# Altium project 175-00024, rev3, Backplane, Instrument Crate.PrjPcb
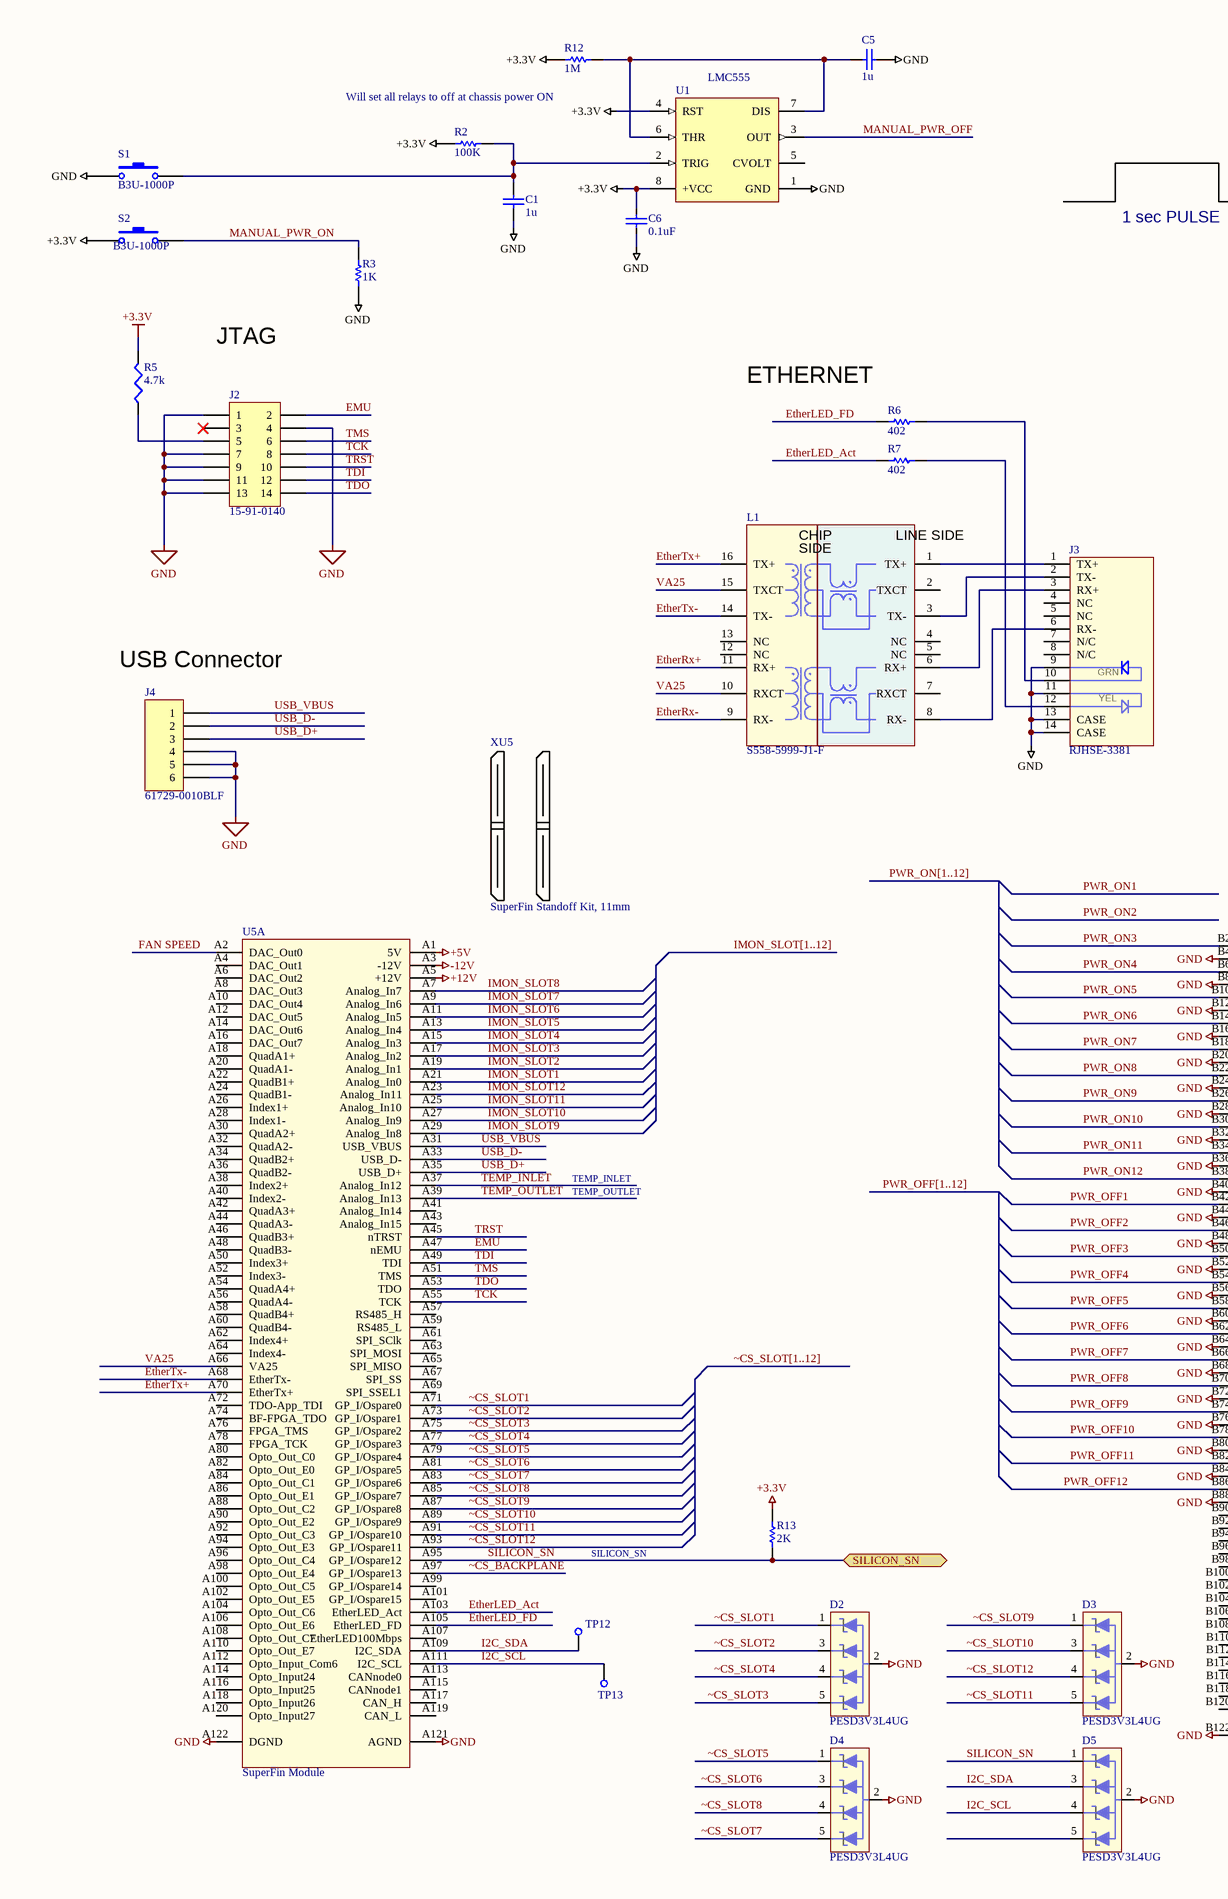
[diagram p0: 780-00029,rev3,Pg3,Backplane, Instrument Crate.SchDoc, left]
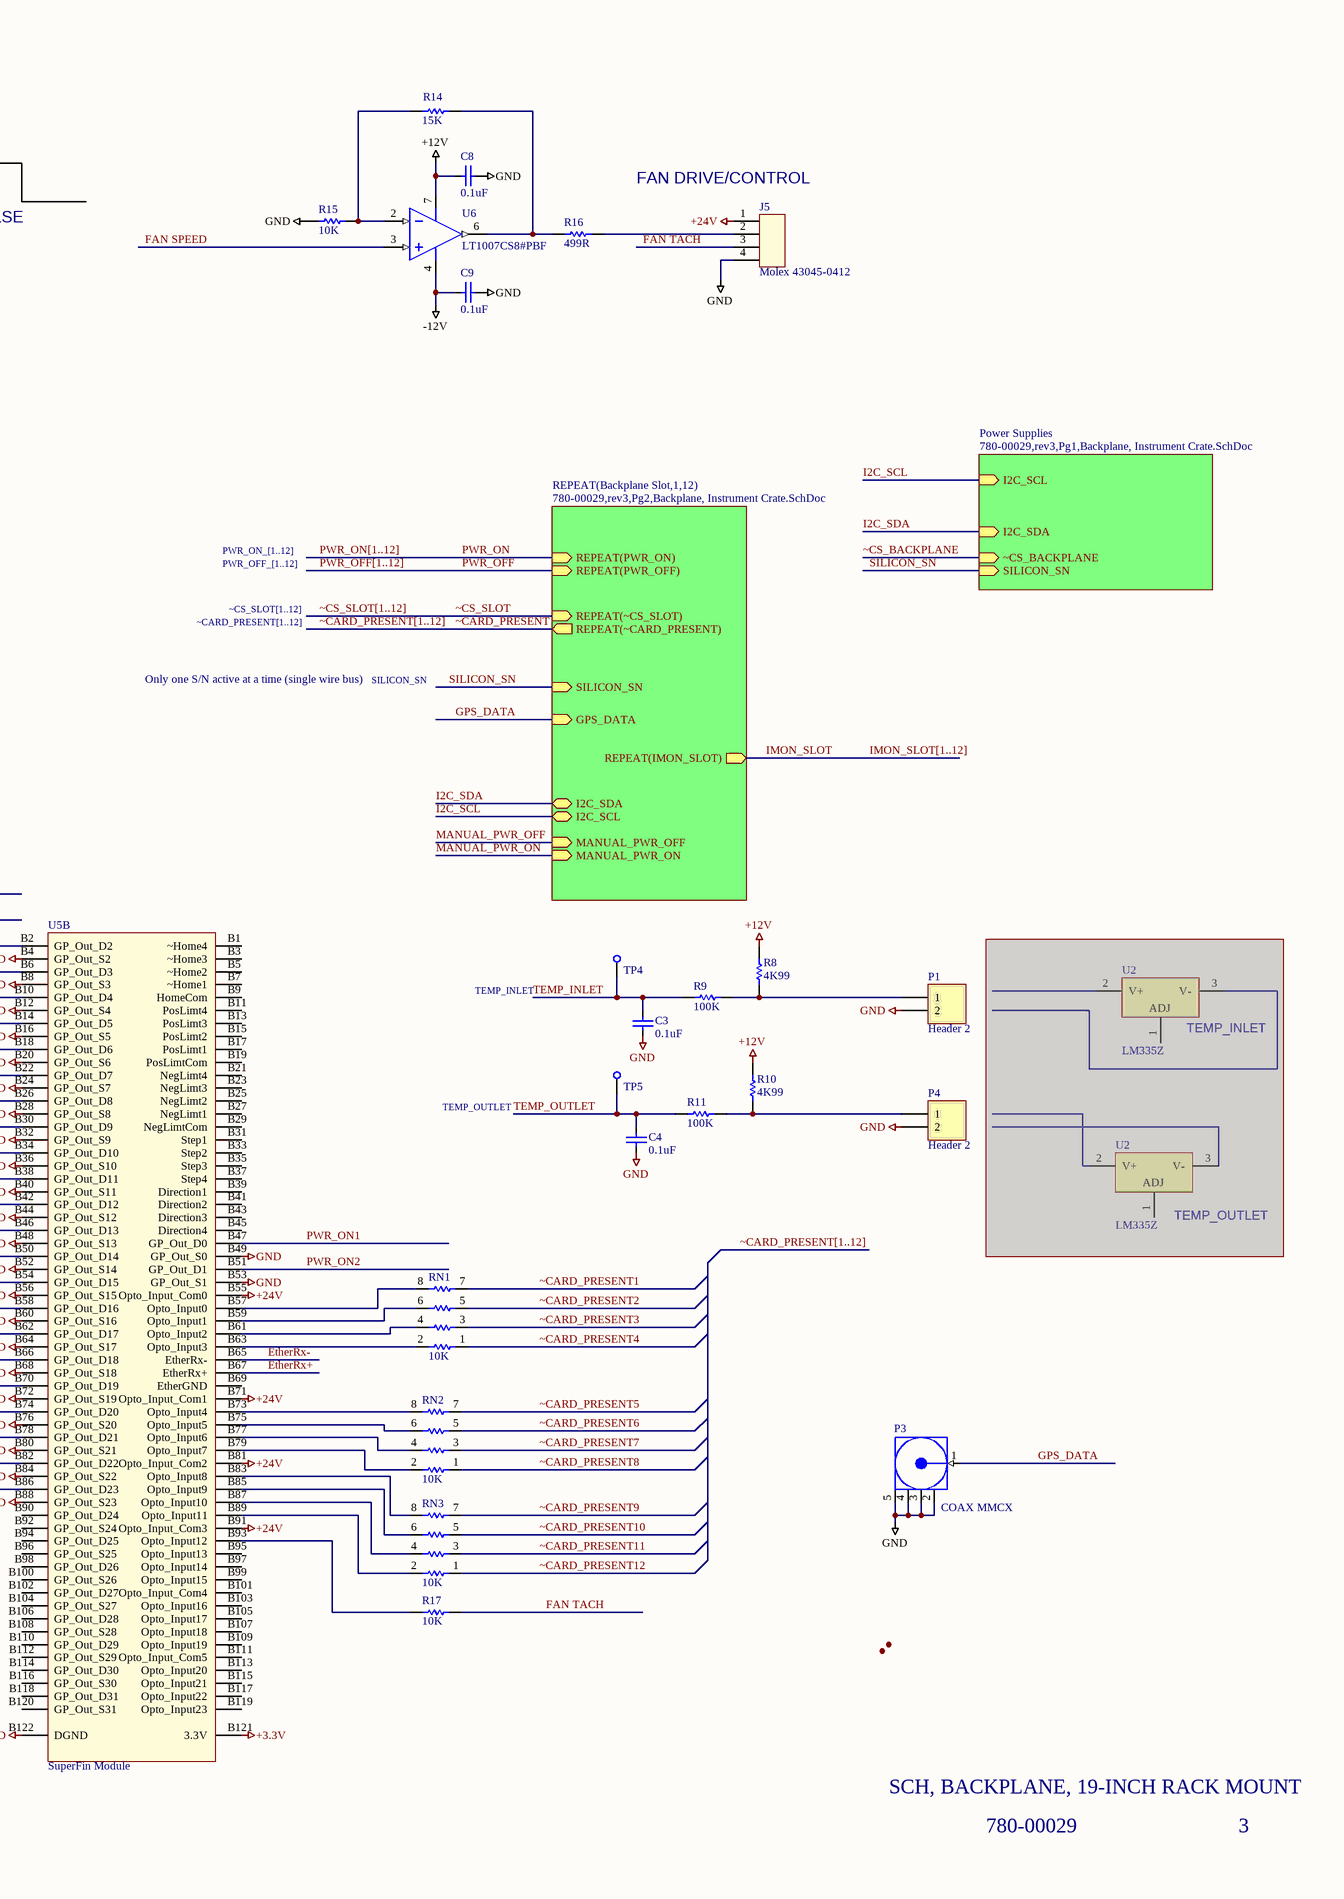
[diagram p1: 780-00029,rev3,Pg3,Backplane, Instrument Crate.SchDoc, right]
2 sheets, 289 parts. Net scope: hierarchical (ports join the sheet entries above them; power ports are global).
Board file: 175-00024_rev3, Backplane, Instrument Crate.PcbDoc
Sheets:
  780-00029,rev3,Pg3,Backplane, Instrument Crate.SchDoc
    Backplane Slot1 = 780-00029,rev3,Pg2,Backplane, Instrument Crate.SchDoc
    Backplane Slot2 = 780-00029,rev3,Pg2,Backplane, Instrument Crate.SchDoc
    Backplane Slot3 = 780-00029,rev3,Pg2,Backplane, Instrument Crate.SchDoc
    Backplane Slot4 = 780-00029,rev3,Pg2,Backplane, Instrument Crate.SchDoc
    Backplane Slot5 = 780-00029,rev3,Pg2,Backplane, Instrument Crate.SchDoc
    Backplane Slot6 = 780-00029,rev3,Pg2,Backplane, Instrument Crate.SchDoc
    Backplane Slot7 = 780-00029,rev3,Pg2,Backplane, Instrument Crate.SchDoc
    Backplane Slot8 = 780-00029,rev3,Pg2,Backplane, Instrument Crate.SchDoc
    Backplane Slot9 = 780-00029,rev3,Pg2,Backplane, Instrument Crate.SchDoc
    Backplane Slot10 = 780-00029,rev3,Pg2,Backplane, Instrument Crate.SchDoc
    Backplane Slot11 = 780-00029,rev3,Pg2,Backplane, Instrument Crate.SchDoc
    Backplane Slot12 = 780-00029,rev3,Pg2,Backplane, Instrument Crate.SchDoc

## Sheet 780-00029,rev3,Pg3,Backplane, Instrument Crate.SchDoc
size C

### Parts
(Parts that share a designator on the sheet are numbered #1, #2 ... from top to bottom, then left to right.)
C1  1u  [2012[0805]]
C3  value 0.1uF  [SMD_0805]  (hidden comment: Cap SMD)
C4  value 0.1uF  [SMD_0805]  (hidden comment: Cap SMD)
C5  1u  [SMD_0805]
C6  value 0.1uF  [SMD_0805]  (hidden comment: Cap SMD)
C8  value 0.1uF  [SMD_0805]  (hidden comment: Cap SMD)
C9  value 0.1uF  [SMD_0805]  (hidden comment: Cap SMD)
D2  PESD3V3L4UG  [SOT-353]
D3  PESD3V3L4UG  [SOT-353]
D4  PESD3V3L4UG  [SOT-353]
D5  PESD3V3L4UG  [SOT-353]
J2  15-91-0140  [HDR2X7]
J3  RJHSE-3381  [RJ45, VERT MOUNT, NO MAGNETICS]
J4  61729-0010BLF  [USB Vertical PCB]
J5  Molex 43045-0412  [CONN Molex Micro-fit, 4 POS]
L1  S558-5999-J1-F  [10/100BT Magetics module]
P1  Header 2  [HDR1X2 for IDC]
P3  COAX MMCX  [MMCX2.54-V5]
P4  Header 2  [HDR1X2 for IDC]
R2  value 100K  [SMD_0805]  (hidden comment: Res 0805)
R3  value 1K  [SMD_0805]  (hidden comment: Res 0805)
R5  4.7k  [2012[0805]]
R6  value 402  [SMD_0805]  (hidden comment: Res 0805)
R7  value 402  [SMD_0805]  (hidden comment: Res 0805)
R8  value 4K99  [SMD_0805]  (hidden comment: Res 0805)
R9  value 100K  [SMD_0805]  (hidden comment: Res 0805)
R10  value 4K99  [SMD_0805]  (hidden comment: Res 0805)
R11  value 100K  [SMD_0805]  (hidden comment: Res 0805)
R12  value 1M  [SMD_0805]  (hidden comment: Res 0805)
R13  value 2K  [SMD_0805]  (hidden comment: Res 0805)
R14  value 15K  [SMD_0805]  (hidden comment: Res 0805)
R15  value 10K  [SMD_0805]  (hidden comment: Res 0805)
R16  value 499R  [SMD_0805]  (hidden comment: Res 0805)
R17  value 10K  [SMD_0805]  (hidden comment: Res 0805)
RN1  value 10K  [RES ARRAY 0603 x 4]  (hidden comment: RES ARRAY  x4 10K)
RN2  value 10K  [RES ARRAY 0603 x 4]  (hidden comment: RES ARRAY  x4 10K)
RN3  value 10K  [RES ARRAY 0603 x 4]  (hidden comment: RES ARRAY  x4 10K)
S1  B3U-1000P  [B3U-1000P]
S2  B3U-1000P  [B3U-1000P]
TP4  Test Point SMD  [SMD_TEST POINT]  (value not drawn)
TP5  Test Point SMD  [SMD_TEST POINT]  (value not drawn)
TP12  Test Point SMD  [SMD_TEST POINT]  (value not drawn)
TP13  Test Point SMD  [SMD_TEST POINT]  (value not drawn)
U1  value LMC555  [M08A_M]  (hidden comment: LM555CMX)
U2#1  LM335Z  [Z03A]  (masked out: inside a compile mask, not in the netlist)
U2#2  LM335Z  [Z03A]  (masked out: inside a compile mask, not in the netlist)
U5  SuperFin Module  [SuperFin Footprint]  (parts A,B of 2)
U6  LT1007CS8#PBF  [S8_M]
XU5  SuperFin Standoff Kit, 11mm  (mechanical)

### Sub-sheets
Power Supplies = 780-00029,rev3,Pg1,Backplane, Instrument Crate.SchDoc (file not in this document): I2C_SCL (in), I2C_SDA (in), ~CS_BACKPLANE (in), SILICON_SN (in)
REPEAT(Backplane Slot,1,12) = 780-00029,rev3,Pg2,Backplane, Instrument Crate.SchDoc: MANUAL_PWR_OFF (in), MANUAL_PWR_ON (in), REPEAT(PWR_OFF) (in), REPEAT(PWR_ON) (in), GPS_DATA (in), I2C_SDA, I2C_SCL, REPEAT(~CS_SLOT) (in), REPEAT(~CARD_PRESENT) (out), SILICON_SN (in), REPEAT(IMON_SLOT) (out)

### Ports
SILICON_SN (bidir)

### Nets
+3.3V: C6.2 R2.2 R5.2 R12.1 R13.2 S2.1 U1.4(RST) U1.8(+VCC) U5.B121(3.3V)
+5V: U5.A1(5V)
+12V: C8.1 R8.2 R10.2 U5.A5(+12V) U6.7(V+)
+24V: J5.1 U5.B55(Opto_Input_Com0) U5.B71(Opto_Input_Com1) U5.B81(Opto_Input_Com2) U5.B91(Opto_Input_Com3)
-12V: C9.1 U5.A3(-12V) U6.4(V-)
GND: C1.1 C3.1 C4.1 C5.2 C6.1 C8.2 C9.2 D2.2 D3.2 D4.2 D5.2 J2.1 J2.4 J2.7 J2.9 J2.11 J2.13 J3.9(GRN-Anode) J3.11(YEL-Cathode) J3.13(CASE) J3.14(CASE) J4.4 J4.5 J4.6 J5.4 P1.2 P3.2(GND) P3.3(GND) P3.4(GND) P3.5(GND) P4.2 R3.1 R15.1 S1.1 U1.1(GND) U5.A121(AGND) U5.A122(DGND) U5.B4(GP_Out_S2) U5.B8(GP_Out_S3) U5.B12(GP_Out_S4) U5.B16(GP_Out_S5) U5.B20(GP_Out_S6) U5.B24(GP_Out_S7) U5.B28(GP_Out_S8) U5.B32(GP_Out_S9) U5.B36(GP_Out_S10) U5.B40(GP_Out_S11) U5.B44(GP_Out_S12) U5.B48(GP_Out_S13) U5.B49(GP_Out_S0) U5.B52(GP_Out_S14) U5.B53(GP_Out_S1) U5.B56(GP_Out_S15) U5.B60(GP_Out_S16) U5.B64(GP_Out_S17) U5.B68(GP_Out_S18) U5.B72(GP_Out_S19) U5.B76(GP_Out_S20) U5.B80(GP_Out_S21) U5.B84(GP_Out_S22) U5.B88(GP_Out_S23) U5.B122(DGND)
EMU: J2.2 U5.A47(nEMU)
EtherLED_Act: R7.1 U5.A103(EtherLED_Act)
EtherLED_FD: R6.1 U5.A105(EtherLED_FD)
EtherRx+: L1.11(RX+) U5.B67(EtherRx+)
EtherRx-: L1.9(RX-) U5.B65(EtherRx-)
EtherTx+: L1.16(TX+) U5.A70(EtherTx+)
EtherTx-: L1.14(TX-) U5.A68(EtherTx-)
FAN SPEED: U5.A2(DAC_Out0) U6.3(IN+)
FAN TACH: J5.3 R17.2
GPS_DATA: P3.1(Signal) ; sheet REPEAT(Backplane Slot,1,12)/GPS_DATA
I2C_SCL: D5.4 TP13.1(TP) U5.A111(I2C_SCL) ; sheet REPEAT(Backplane Slot,1,12)/I2C_SCL, sheet Power Supplies/I2C_SCL
I2C_SDA: D5.3 TP12.1(TP) U5.A109(I2C_SDA) ; sheet REPEAT(Backplane Slot,1,12)/I2C_SDA, sheet Power Supplies/I2C_SDA
IMON_SLOT: sheet REPEAT(Backplane Slot,1,12)/REPEAT(IMON_SLOT)
IMON_SLOT1: U5.A21(Analog_In0)
IMON_SLOT2: U5.A19(Analog_In1)
IMON_SLOT3: U5.A17(Analog_In2)
IMON_SLOT4: U5.A15(Analog_In3)
IMON_SLOT5: U5.A13(Analog_In4)
IMON_SLOT6: U5.A11(Analog_In5)
IMON_SLOT7: U5.A9(Analog_In6)
IMON_SLOT8: U5.A7(Analog_In7)
IMON_SLOT9: U5.A29(Analog_In8)
IMON_SLOT10: U5.A27(Analog_In9)
IMON_SLOT11: U5.A25(Analog_In10)
IMON_SLOT12: U5.A23(Analog_In11)
MANUAL_PWR_OFF: U1.3(OUT) ; sheet REPEAT(Backplane Slot,1,12)/MANUAL_PWR_OFF
MANUAL_PWR_ON: R3.2 S2.2 ; sheet REPEAT(Backplane Slot,1,12)/MANUAL_PWR_ON
PWR_OFF: sheet REPEAT(Backplane Slot,1,12)/REPEAT(PWR_OFF)
PWR_OFF1: U5.B42(GP_Out_D12)
PWR_OFF2: U5.B46(GP_Out_D13)
PWR_OFF3: U5.B50(GP_Out_D14)
PWR_OFF4: U5.B54(GP_Out_D15)
PWR_OFF5: U5.B58(GP_Out_D16)
PWR_OFF6: U5.B62(GP_Out_D17)
PWR_OFF7: U5.B66(GP_Out_D18)
PWR_OFF8: U5.B70(GP_Out_D19)
PWR_OFF9: U5.B74(GP_Out_D20)
PWR_OFF10: U5.B78(GP_Out_D21)
PWR_OFF11: U5.B82(GP_Out_D22)
PWR_OFF12: U5.B86(GP_Out_D23)
PWR_ON: sheet REPEAT(Backplane Slot,1,12)/REPEAT(PWR_ON)
PWR_ON1: U5.B47(GP_Out_D0)
PWR_ON2: U5.B51(GP_Out_D1)
PWR_ON3: U5.B2(GP_Out_D2)
PWR_ON4: U5.B6(GP_Out_D3)
PWR_ON5: U5.B10(GP_Out_D4)
PWR_ON6: U5.B14(GP_Out_D5)
PWR_ON7: U5.B18(GP_Out_D6)
PWR_ON8: U5.B22(GP_Out_D7)
PWR_ON9: U5.B26(GP_Out_D8)
PWR_ON10: U5.B30(GP_Out_D9)
PWR_ON11: U5.B34(GP_Out_D10)
PWR_ON12: U5.B38(GP_Out_D11)
SILICON_SN: D5.1 R13.1 U5.A95(GP_I/Ospare12) ; port SILICON_SN, sheet REPEAT(Backplane Slot,1,12)/SILICON_SN, sheet Power Supplies/SILICON_SN
TCK: J2.8 U5.A55(TCK)
TDI: J2.12 U5.A49(TDI)
TDO: J2.14 U5.A53(TDO)
TEMP_INLET: C3.2 R9.1 TP4.1(TP) U5.A37(Analog_In12)
TEMP_OUTLET: C4.2 R11.1 TP5.1(TP) U5.A39(Analog_In13)
TMS: J2.6 U5.A51(TMS)
TRST: J2.10 U5.A45(nTRST)
USB_D+: J4.3 U5.A35(USB_D+)
USB_D-: J4.2 U5.A33(USB_D-)
USB_VBUS: J4.1 U5.A31(USB_VBUS)
VA25: L1.10(RXCT) L1.15(TXCT) U5.A66(VA25)
~CARD_PRESENT: sheet REPEAT(Backplane Slot,1,12)/REPEAT(~CARD_PRESENT)
~CARD_PRESENT1: RN1.7
~CARD_PRESENT2: RN1.5
~CARD_PRESENT3: RN1.3
~CARD_PRESENT4: RN1.1
~CARD_PRESENT5: RN2.7
~CARD_PRESENT6: RN2.5
~CARD_PRESENT7: RN2.3
~CARD_PRESENT8: RN2.1
~CARD_PRESENT9: RN3.7
~CARD_PRESENT10: RN3.5
~CARD_PRESENT11: RN3.3
~CARD_PRESENT12: RN3.1
~CS_BACKPLANE: U5.A97(GP_I/Ospare13) ; sheet Power Supplies/~CS_BACKPLANE
~CS_SLOT: sheet REPEAT(Backplane Slot,1,12)/REPEAT(~CS_SLOT)
~CS_SLOT1: D2.1 U5.A71(GP_I/Ospare0)
~CS_SLOT2: D2.3 U5.A73(GP_I/Ospare1)
~CS_SLOT3: D2.5 U5.A75(GP_I/Ospare2)
~CS_SLOT4: D2.4 U5.A77(GP_I/Ospare3)
~CS_SLOT5: D4.1 U5.A79(GP_I/Ospare4)
~CS_SLOT6: D4.3 U5.A81(GP_I/Ospare5)
~CS_SLOT7: D4.5 U5.A83(GP_I/Ospare6)
~CS_SLOT8: D4.4 U5.A85(GP_I/Ospare7)
~CS_SLOT9: D3.1 U5.A87(GP_I/Ospare8)
~CS_SLOT10: D3.3 U5.A89(GP_I/Ospare9)
~CS_SLOT11: D3.5 U5.A91(GP_I/Ospare10)
~CS_SLOT12: D3.4 U5.A93(GP_I/Ospare11)
NetC1_2: C1.2 R2.1 S1.2 U1.2(TRIG)
NetC5_1: C5.1 R12.2 U1.6(THR) U1.7(DIS)
NetJ2_5: J2.5 R5.1
NetJ3_1: J3.1(TX+) L1.1(TX+)
NetJ3_2: J3.2(TX-) L1.3(TX-)
NetJ3_3: J3.3(RX+) L1.6(RX+)
NetJ3_6: J3.6(RX-) L1.8(RX-)
NetJ3_10: J3.10(GRN-Cathode) R6.2
NetJ3_12: J3.12(YEL-Anode) R7.2
NetJ5_2: J5.2 R16.1
NetP1_1: P1.1 R8.1 R9.2
NetP4_1: P4.1 R10.1 R11.2
NetR14_1: R14.1 R15.2 U6.2(IN-)
NetR14_2: R14.2 R16.2 U6.6(OUT)
NetR17_1: R17.1 U5.B93(Opto_Input12)
NetRN1_2: RN1.2 U5.B63(Opto_Input3)
NetRN1_4: RN1.4 U5.B61(Opto_Input2)
NetRN1_6: RN1.6 U5.B59(Opto_Input1)
NetRN1_8: RN1.8 U5.B57(Opto_Input0)
NetRN2_2: RN2.2 U5.B79(Opto_Input7)
NetRN2_4: RN2.4 U5.B77(Opto_Input6)
NetRN2_6: RN2.6 U5.B75(Opto_Input5)
NetRN2_8: RN2.8 U5.B73(Opto_Input4)
NetRN3_2: RN3.2 U5.B89(Opto_Input11)
NetRN3_4: RN3.4 U5.B87(Opto_Input10)
NetRN3_6: RN3.6 U5.B85(Opto_Input9)
NetRN3_8: RN3.8 U5.B83(Opto_Input8)

Not connected (* = marked no-connect by the designer): D5 5; J2 3*; J3 4(NC) 5(NC) 7(N/C) 8(N/C); L1 2(TXCT) 4(NC) 5(NC) 7(RXCT) 12(NC) 13(NC); U1 5(CVOLT); U5 A4(DAC_Out1) A6(DAC_Out2) A8(DAC_Out3) A10(DAC_Out4) A12(DAC_Out5) A14(DAC_Out6) A16(DAC_Out7) A18(QuadA1+) A20(QuadA1-) A22(QuadB1+) A24(QuadB1-) A26(Index1+) A28(Index1-) A30(QuadA2+) A32(QuadA2-) A34(QuadB2+) A36(QuadB2-) A38(Index2+) A40(Index2-) A41(Analog_In14) A42(QuadA3+) A43(Analog_In15) A44(QuadA3-) A46(QuadB3+) A48(QuadB3-) A50(Index3+) A52(Index3-) A54(QuadA4+) A56(QuadA4-) A57(RS485_H) A58(QuadB4+) A59(RS485_L) A60(QuadB4-) A61(SPI_SClk) A62(Index4+) A63(SPI_MOSI) A64(Index4-) A65(SPI_MISO) A67(SPI_SS) A69(SPI_SSEL1) A72(TDO-App_TDI) A74(BF-FPGA_TDO) A76(FPGA_TMS) A78(FPGA_TCK) A80(Opto_Out_C0) A82(Opto_Out_E0) A84(Opto_Out_C1) A86(Opto_Out_E1) A88(Opto_Out_C2) A90(Opto_Out_E2) A92(Opto_Out_C3) A94(Opto_Out_E3) A96(Opto_Out_C4) A98(Opto_Out_E4) A99(GP_I/Ospare14) A100(Opto_Out_C5) A101(GP_I/Ospare15) A102(Opto_Out_E5) A104(Opto_Out_C6) A106(Opto_Out_E6) A107(EtherLED100Mbps) A108(Opto_Out_C7) A110(Opto_Out_E7) A112(Opto_Input_Com6) A113(CANnode0) A114(Opto_Input24) A115(CANnode1) A116(Opto_Input25) A117(CAN_H) A118(Opto_Input26) A119(CAN_L) A120(Opto_Input27) B1(~Home4) B3(~Home3) B5(~Home2) B7(~Home1) B9(HomeCom) B11(PosLimt4) B13(PosLimt3) B15(PosLimt2) B17(PosLimt1) B19(PosLimtCom) B21(NegLimt4) B23(NegLimt3) B25(NegLimt2) B27(NegLimt1) B29(NegLimtCom) B31(Step1) B33(Step2) B35(Step3) B37(Step4) B39(Direction1) B41(Direction2) B43(Direction3) B45(Direction4) B69(EtherGND) B90(GP_Out_D24) B92(GP_Out_S24) B94(GP_Out_D25) B95(Opto_Input13) B96(GP_Out_S25) B97(Opto_Input14) B98(GP_Out_D26) B99(Opto_Input15) B100(GP_Out_S26) B101(Opto_Input_Com4) B102(GP_Out_D27) B103(Opto_Input16) B104(GP_Out_S27) B105(Opto_Input17) B106(GP_Out_D28) B107(Opto_Input18) B108(GP_Out_S28) B109(Opto_Input19) B110(GP_Out_D29) B111(Opto_Input_Com5) B112(GP_Out_S29) B113(Opto_Input20) B114(GP_Out_D30) B115(Opto_Input21) B116(GP_Out_S30) B117(Opto_Input22) B118(GP_Out_D31) B119(Opto_Input23) B120(GP_Out_S31); U6 1(VOSTRIM) 5(NC) 8(VOSTRIM)

### Buses and harness runs
bus IMON_SLOT[1..12]
bus PWR_OFF[1..12]
bus PWR_ON[1..12]
bus ~CARD_PRESENT[1..12]
bus ~CS_SLOT[1..12]

### Notes on the sheet
- Will set all relays to off at chassis power ON
- (near J5) FAN DRIVE/CONTROL
- 1 sec PULSE
- JTAG
- ETHERNET
- PWR_OFF_[1..12]
- PWR_ON_[1..12]
- ~CARD_PRESENT[1..12]
- ~CS_SLOT[1..12]
- (near J4) USB Connector
- Only one S/N active at a time (single wire bus)
- SILICON_SN
- TEMP_INLET
- (near U2#1) TEMP_INLET
- TEMP_OUTLET
- (near U2#2) TEMP_OUTLET
- SCH, BACKPLANE, 19-INCH RACK MOUNT
- 780-00029
- 3
- (in symbol CONN RJ-45 w/o magnetics) GRN; YEL
- (in symbol Ethernet Magnetics module) CHIP; LINE SIDE; SIDE

### Library data of the parts
C1 C5 = Cap: Capacitor; Manufacturer: Taiyo Yuden; Manuf p/n: UMK212F105ZG-T; Vendor: DIGIKEY; Vendor Mult.: 10; Vendor p/n: 587-1308-1-ND; LCO p/n: 120-00027; Value: 1u; COST: 0.088
C3 C4 C6 C8 C9 = Cap SMD: Capacitor; LCO p/n: 120-00002
D2-D5 = ESD Diode 3.3V Quad: Quad ESD Diode 3.3V; Manufacturer: NXP; Manuf p/n: PESD3V3L4UG,115; LCO p/n: 140-00011; VALUE: 3V3; Vendor: DigiKey; Vendor Mult.: 1; Vendor p/n: 568-4042-1-ND; COST: 0.52
J2 = Header 7X2: Header, 7-Pin, Dual row; Manufacturer: Molex/Waldom; Vendor: DIGIKEY; Vendor Mult.: 1; LCO p/n: 125-00005; Value: HEADER 7X2
J3 = CONN RJ-45 w/o magnetics: Vertical PC mount, w/o magnetics; LCO p/n: 125-00040
J4 = Header 6: Header, 6-Pin; Manufacturer: FCI; Value: USB TYPE B; Vendor: DigiKey; Vendor Mult.: 1; LCO p/n: 125-00039; COST: 1.12
J5 = CONN 4 pin 3mm: Molex Micro Fit 3, Vert PC mount; LCO p/n: 125-00121; Vendor: Digi-Key; Vendor Mult.: 1; Vendor p/n: WM1790-ND; Manufacturer: Molex; Manuf p/n: 43045-0412
L1 = Ethernet Magnetics module: 10/100BT Magnetics Module; LCO p/n: 155-00014
P1 P4 = Header 2: Header, 2-Pin; Manufacturer: TE Connectivity; Manuf p/n: 640456-2; Vendor: Digi-Key; Vendor p/n: A1921-ND; LCO p/n: 125-00110; VALUE: Header 2
P3 = COAX-M: RF Coaxial PCB Connector, MMCX; Thru-Hole, Vertical Mount Plug,  50 Ohm Impedance; Manufacturer: Emerson; Manuf p/n: 135-3701-201; Vendor: DigiKey; Vendor p/n: J597-ND; VALUE: COAX-M; Vendor Mult.: 1; LCO p/n: 125-00054; COST: 5.24
R2 R9 R11 = Res SMD: Resistor 0805; Manufacturer: Vishay/Dale; Manuf p/n: CRCW0805100KFKEA; Vendor: DIGIKEY; Vendor p/n: 541-100KCCT-ND; Vendor Mult.: 10; LCO p/n: 181-01003; COST: 0.09
R3 = Res SMD: Resistor 0805; Manufacturer: Vishay/Dale; Manuf p/n: CRCW08051KFKEA; Vendor: DIGIKEY; Vendor p/n: 541-1KCCT-ND; Vendor Mult.: 10; LCO p/n: 181-01001; COST: 0.09
R5 = Res3: Resistor; Manufacturer: Dale/Vishay; Manuf p/n: CRCW08054.75KFKEA; Value: 4.75K; Vendor: DIGIKEY; Vendor Mult.: 10; Vendor p/n: 541-4.75KCCT-ND; LCO p/n: 181-04751; COST: 0.08
R6 R7 = Res SMD: Resistor 0805; Manufacturer: Vishay/Dale; Manuf p/n: CRCW0805402FKEA; Vendor: DIGIKEY; Vendor p/n: 541-402CCT-ND; Vendor Mult.: 10; LCO p/n: 181-04020; COST: 0.09
R8 R10 = Res SMD: Resistor 0805; Manufacturer: Vishay/Dale; Manuf p/n: CRCW08054K99FKEA; Vendor: DIGIKEY; Vendor p/n: 541-4K99CCT-ND; Vendor Mult.: 10; LCO p/n: 181-04991; COST: 0.09
R12 = Res SMD: Resistor 0805; Manufacturer: Vishay/Dale; Vendor: DIGIKEY; LCO p/n: 181-01004; COST: 0.09
R13 = Res SMD: Resistor 0805; Manufacturer: Vishay/Dale; Manuf p/n: CRCW08052KFKEA; Vendor: DIGIKEY; Vendor p/n: 541-2KCCT-ND; Vendor Mult.: 10; LCO p/n: 181-02001; COST: 0.09
R14 = Res SMD: Resistor 0805; Manufacturer: Vishay/Dale; Manuf p/n: CRCW080515KFKEA; Vendor: DIGIKEY; Vendor p/n: 541-15KCCT-ND; Vendor Mult.: 10; LCO p/n: 181-01502; COST: 0.09
R15 R17 = Res SMD: Resistor 0805; Manufacturer: Vishay/Dale; Manuf p/n: CRCW080510KFKEA; Vendor: DIGIKEY; Vendor p/n: 541-10KCCT-ND; Vendor Mult.: 10; LCO p/n: 181-01002; COST: 0.09
R16 = Res SMD: Resistor 0805; Manufacturer: Vishay/Dale; Manuf p/n: CRCW0805499RFKEA; Vendor: DIGIKEY; Vendor p/n: 541-499RCCT-ND; Vendor Mult.: 10; LCO p/n: 181-04990; COST: 0.09
RN1-RN3 = RES ARRAY  x4 10K: Resistor Array 4 Isolated; Manufacturer: PANASONIC - ECG; Manuf p/n: EXB-38V103JV; Vendor: DIGIKEY; Vendor p/n: Y9103CT-ND; Vendor Mult.: 10; LCO p/n: 180-00043; COST: 0.03
S1 S2 = SW-PB: Switch; Manufacturer: Omron Electronics; Vendor: DIGIKEY; Vendor Mult.: 1; Vendor p/n: SW1020CT-ND; Value: SW PB; LCO p/n: 185-00005; COST: 0.96; Manuf p/n: B3U-1000P
TP4 TP5 TP12 TP13 = Test Point SMD: SMD loop test point; LCO p/n: 160-00001; VALUE: Test Point SMD
U1 = LM555CMX: Timer; Manufacturer: National Semiconductor; Manuf p/n: LMC555CMX/NOPB; LCO p/n: 150-00090; Vendor: Digi-Key; Vendor Mult.: 1; Vendor p/n: LMC555CMXCT-ND
U2#1 U2#2 = LM335Z: Precision Temperature Sensor; Manufacturer: National Semiconductor; LCO p/n: 150-00068
U5 = SuperFin Module: LCO p/n: 830-00010
U6 = LT1007CS8#PBF: Low Noise BJT input opamp; Manufacturer: Linear Tech; LCO p/n: 150-00067; VALUE: LT1007; Vendor: DigiKey; Vendor Mult.: 1; Vendor p/n: LT1007CS8#PBF-ND; COST: 4.13; Manuf p/n: LT1007CS8#PBF
XU5 = SuperFin Standoff Kit, 11mm: LCO p/n: 810-00005

## Sheet 780-00029,rev3,Pg2,Backplane, Instrument Crate.SchDoc
size B; PageSetup: Record=PageOptions|CenterHorizontal=True|CenterVertical=True|PrintScale=1.09|XCorrection=1.00|YCorrection=1.00|PrintKind=0|BorderSize=5000000|LeftOffset=0|BottomOffset=0|Orientation=2|PaperLength=1000|PaperWidth=1000|Scale=100|PaperSource=7|PrintQuality=-4|MediaType=1|DitherType=10|PaperKind=Tabloid 11 x 17in|PrintScaleMode=1
Used 12 times, as channels Backplane Slot1, Backplane Slot2, Backplane Slot3, Backplane Slot4, Backplane Slot5, Backplane Slot6, Backplane Slot7, Backplane Slot8, Backplane Slot9, Backplane Slot10, Backplane Slot11, Backplane Slot12. Parts and nets are listed once, with the designators drawn on the sheet.
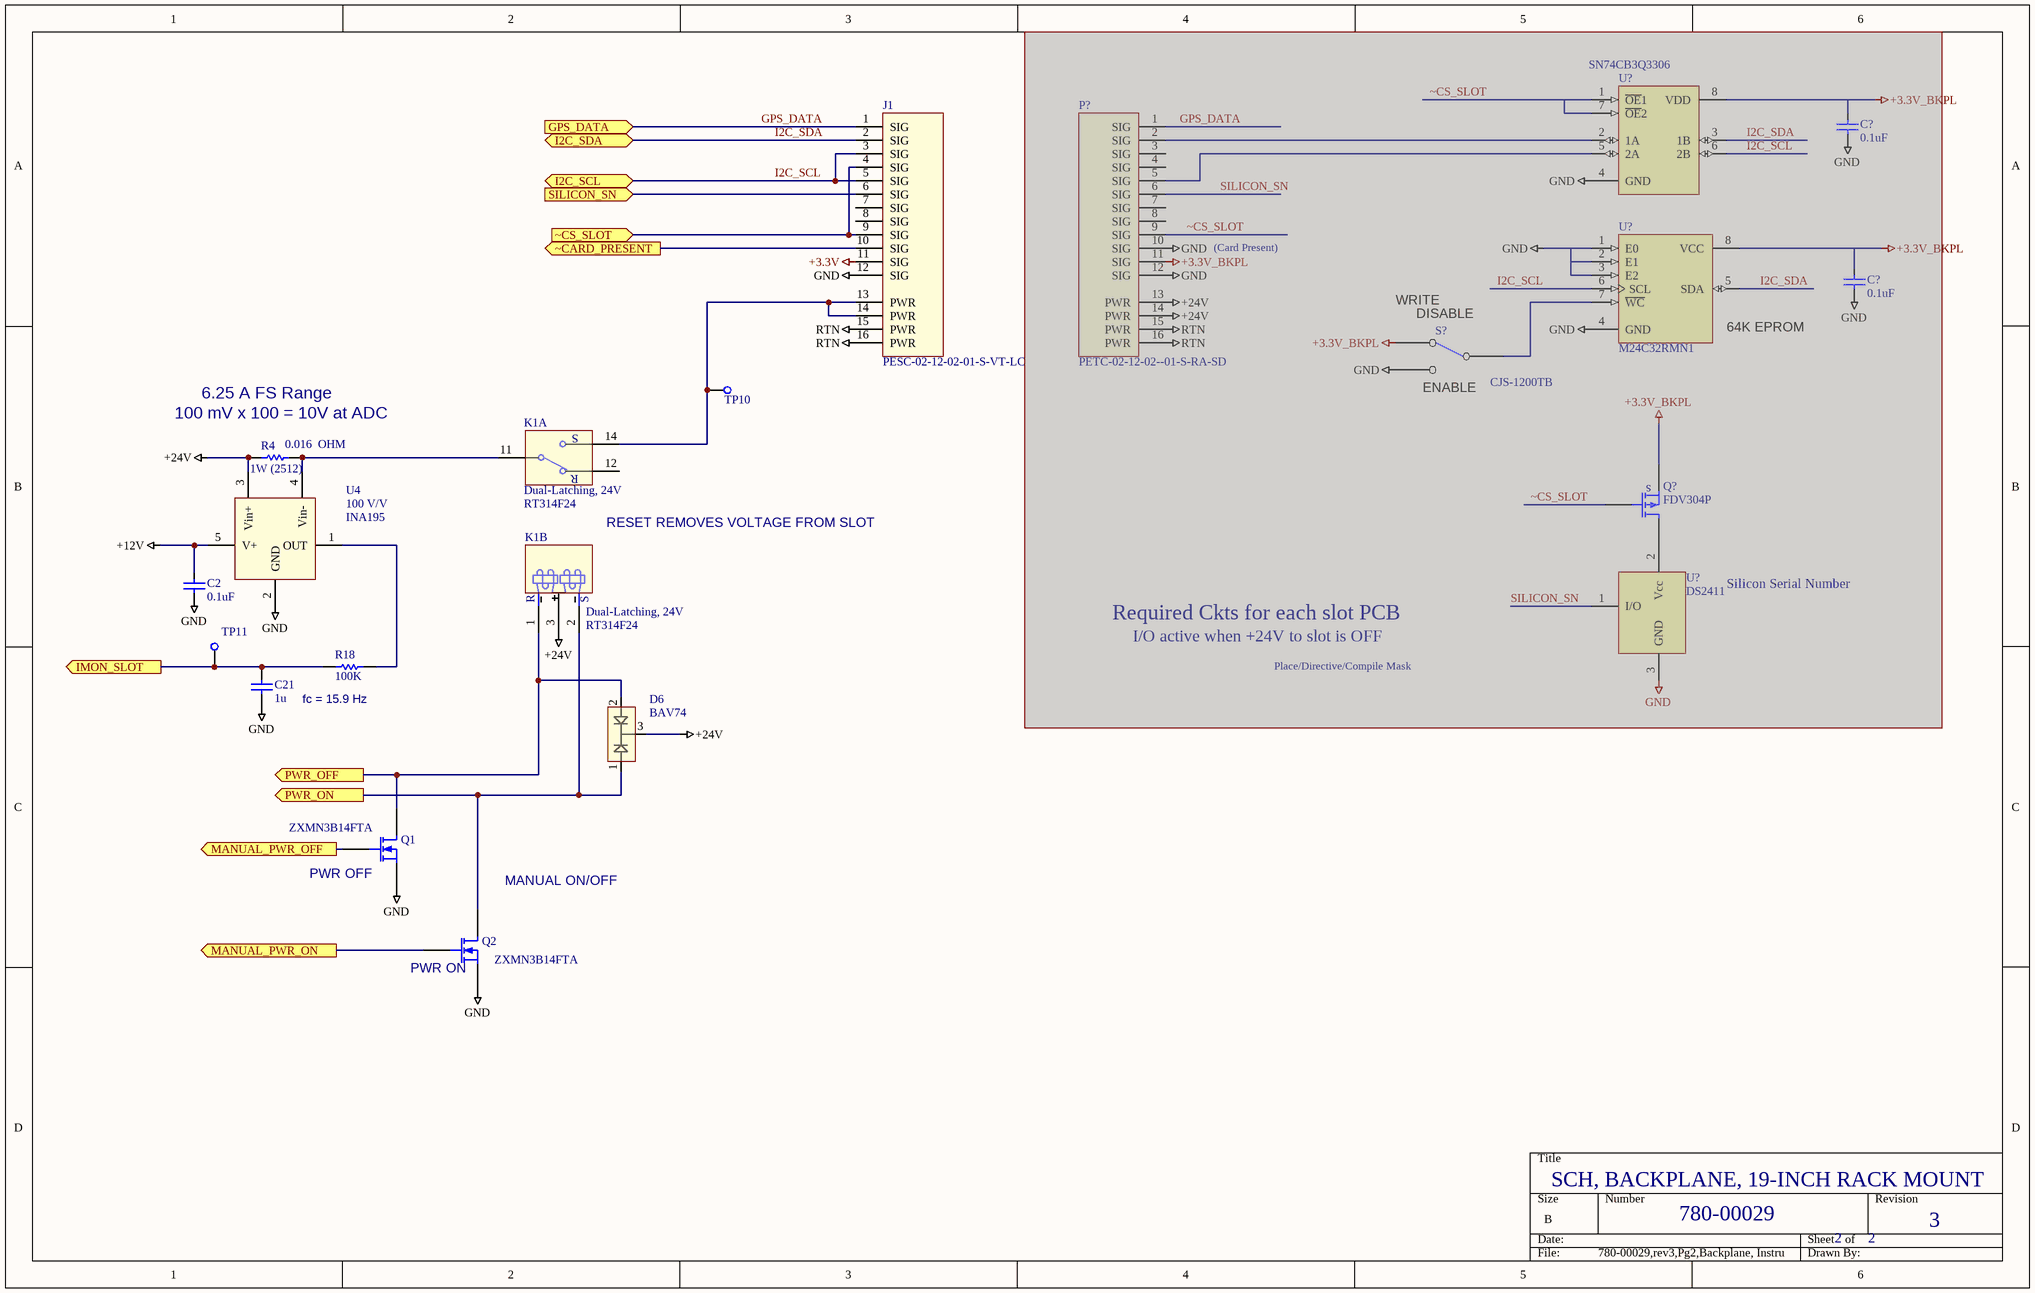
[diagram p2: 780-00029,rev3,Pg2,Backplane, Instrument Crate.SchDoc]

### Parts
(Parts that share a designator on the sheet are numbered #1, #2 ... from top to bottom, then left to right.)
C2  value 0.1uF  [SMD_0805]  (hidden comment: Cap SMD)
C21  1u  [SMD_0805]
C?#1  value 0.1uF  [SMD_0805]  (hidden comment: Cap SMD)  (masked out: inside a compile mask, not in the netlist)
C?#2  value 0.1uF  [SMD_0805]  (hidden comment: Cap SMD)  (masked out: inside a compile mask, not in the netlist)
D6  BAV74  [SOT23A]
J1  PESC-02-12-02-01-S-VT-LC  [PESC-02-12-02-01-S-VT-LC]
K1  Dual-Latching, 24V  value RT314F24  [RELAY, TYCO RT1]  (parts A,B of 2)
P?  PETC-02-12-02--01-S-RA-SD  [PETC-02-12-02-01-RA]  (masked out: inside a compile mask, not in the netlist)
Q1  ZXMN3B14FTA  [SOT-23B]
Q2  ZXMN3B14FTA  [SOT-23B]
Q?  FDV304P  [SMD_SOT23_3]  (masked out: inside a compile mask, not in the netlist)
R4  1W (2512)  value 0.016  OHM  [6332[2512]]
R18  value 100K  [SMD_0805]  (hidden comment: Res 0805)
S?  CJS-1200TB  [CAS-120B]  (masked out: inside a compile mask, not in the netlist)
TP10  Test point  [PAD_80D_052H]  (value not drawn)
TP11  Test point  [PAD_80D_052H]  (value not drawn)
U4  100 V/V  value INA195  [SMD_SOT23_5]
U?#1  value SN74CB3Q3306  [PW008_N]  (hidden comment: SN74CBT3306PWLE)  (masked out: inside a compile mask, not in the netlist)
U?#2  M24C32RMN1  [SOP8_N]  (masked out: inside a compile mask, not in the netlist)
U?#3  DS2411  [SMD_SOT23_3]  (masked out: inside a compile mask, not in the netlist)

### Ports
GPS_DATA (in), I2C_SCL, I2C_SDA, IMON_SLOT (out), MANUAL_PWR_OFF (out), MANUAL_PWR_ON (out), PWR_OFF (out), PWR_ON (out), SILICON_SN (in), ~CARD_PRESENT (out), ~CS_SLOT (in)

### Nets
+3.3V: J1.11(SIG)
+12V: C2.2 U4.5(V+)
+24V: D6.3(AC2) K1.3(Com) R4.1 U4.3(Vin+)
GND: C2.1 C21.2 J1.12(SIG) Q1.3(S) Q2.3(S) U4.2(GND)
RTN: J1.15(PWR) J1.16(PWR)
GPS_DATA: J1.1(SIG) ; port GPS_DATA
I2C_SCL: J1.3(SIG) J1.5(SIG) ; port I2C_SCL
I2C_SDA: J1.2(SIG) ; port I2C_SDA
IMON_SLOT: C21.1 R18.1 TP11.1(TP) ; port IMON_SLOT
MANUAL_PWR_OFF: Q1.2(G) ; port MANUAL_PWR_OFF
MANUAL_PWR_ON: Q2.2(G) ; port MANUAL_PWR_ON
PWR_OFF: D6.2(C1) K1.1(Reset) Q1.1(D) ; port PWR_OFF
PWR_ON: D6.1(A1) K1.2(Reset) Q2.1(D) ; port PWR_ON
SILICON_SN: J1.6(SIG) ; port SILICON_SN
~CARD_PRESENT: J1.10(SIG) ; port ~CARD_PRESENT
~CS_SLOT: J1.4(SIG) J1.9(SIG) ; port ~CS_SLOT
NetJ1_13: J1.13(PWR) J1.14(PWR) K1.14(S) TP10.1(TP)
NetK1_11: K1.11(Wiper) R4.2 U4.4(Vin-)
NetR18_2: R18.2 U4.1(OUT)

Not connected (* = marked no-connect by the designer): J1 7(SIG) 8(SIG); K1 12(R)

### Channels
Backplane Slot1: designators C2=C2A C21=C21A C?=C?A#1 C?=C?A#2 D6=D6A J1=J1A K1=K1A P?=P?A Q1=Q1A Q2=Q2A Q?=Q?A R4=R4A R18=R18A S?=S?A TP10=TP10A TP11=TP11A U4=U4A U?=U?A#2 U?=U?A#1 U?=U?A#3; ports GPS_DATA=GPS_DATA I2C_SCL=I2C_SCL I2C_SDA=I2C_SDA IMON_SLOT=IMON_SLOT1 MANUAL_PWR_OFF=MANUAL_PWR_OFF MANUAL_PWR_ON=MANUAL_PWR_ON PWR_OFF=PWR_OFF1 PWR_ON=PWR_ON1 SILICON_SN=SILICON_SN ~CARD_PRESENT=~CARD_PRESENT1 ~CS_SLOT=~CS_SLOT1
Backplane Slot2: designators C2=C2B C21=C21B C?=C?B#1 C?=C?B#2 D6=D6B J1=J1B K1=K1B P?=P?B Q1=Q1B Q2=Q2B Q?=Q?B R4=R4B R18=R18B S?=S?B TP10=TP10B TP11=TP11B U4=U4B U?=U?B#2 U?=U?B#1 U?=U?B#3; ports GPS_DATA=GPS_DATA I2C_SCL=I2C_SCL I2C_SDA=I2C_SDA IMON_SLOT=IMON_SLOT2 MANUAL_PWR_OFF=MANUAL_PWR_OFF MANUAL_PWR_ON=MANUAL_PWR_ON PWR_OFF=PWR_OFF2 PWR_ON=PWR_ON2 SILICON_SN=SILICON_SN ~CARD_PRESENT=~CARD_PRESENT2 ~CS_SLOT=~CS_SLOT2
Backplane Slot3: designators C2=C2C C21=C21C C?=C?C#1 C?=C?C#2 D6=D6C J1=J1C K1=K1C P?=P?C Q1=Q1C Q2=Q2C Q?=Q?C R4=R4C R18=R18C S?=S?C TP10=TP10C TP11=TP11C U4=U4C U?=U?C#2 U?=U?C#1 U?=U?C#3; ports GPS_DATA=GPS_DATA I2C_SCL=I2C_SCL I2C_SDA=I2C_SDA IMON_SLOT=IMON_SLOT3 MANUAL_PWR_OFF=MANUAL_PWR_OFF MANUAL_PWR_ON=MANUAL_PWR_ON PWR_OFF=PWR_OFF3 PWR_ON=PWR_ON3 SILICON_SN=SILICON_SN ~CARD_PRESENT=~CARD_PRESENT3 ~CS_SLOT=~CS_SLOT3
Backplane Slot4: designators C2=C2D C21=C21D C?=C?D#1 C?=C?D#2 D6=D6D J1=J1D K1=K1D P?=P?D Q1=Q1D Q2=Q2D Q?=Q?D R4=R4D R18=R18D S?=S?D TP10=TP10D TP11=TP11D U4=U4D U?=U?D#2 U?=U?D#1 U?=U?D#3; ports GPS_DATA=GPS_DATA I2C_SCL=I2C_SCL I2C_SDA=I2C_SDA IMON_SLOT=IMON_SLOT4 MANUAL_PWR_OFF=MANUAL_PWR_OFF MANUAL_PWR_ON=MANUAL_PWR_ON PWR_OFF=PWR_OFF4 PWR_ON=PWR_ON4 SILICON_SN=SILICON_SN ~CARD_PRESENT=~CARD_PRESENT4 ~CS_SLOT=~CS_SLOT4
Backplane Slot5: designators C2=C2E C21=C21E C?=C?E#1 C?=C?E#2 D6=D6E J1=J1E K1=K1E P?=P?E Q1=Q1E Q2=Q2E Q?=Q?E R4=R4E R18=R18E S?=S?E TP10=TP10E TP11=TP11E U4=U4E U?=U?E#2 U?=U?E#1 U?=U?E#3; ports GPS_DATA=GPS_DATA I2C_SCL=I2C_SCL I2C_SDA=I2C_SDA IMON_SLOT=IMON_SLOT5 MANUAL_PWR_OFF=MANUAL_PWR_OFF MANUAL_PWR_ON=MANUAL_PWR_ON PWR_OFF=PWR_OFF5 PWR_ON=PWR_ON5 SILICON_SN=SILICON_SN ~CARD_PRESENT=~CARD_PRESENT5 ~CS_SLOT=~CS_SLOT5
Backplane Slot6: designators C2=C2F C21=C21F C?=C?F#1 C?=C?F#2 D6=D6F J1=J1F K1=K1F P?=P?F Q1=Q1F Q2=Q2F Q?=Q?F R4=R4F R18=R18F S?=S?F TP10=TP10F TP11=TP11F U4=U4F U?=U?F#2 U?=U?F#1 U?=U?F#3; ports GPS_DATA=GPS_DATA I2C_SCL=I2C_SCL I2C_SDA=I2C_SDA IMON_SLOT=IMON_SLOT6 MANUAL_PWR_OFF=MANUAL_PWR_OFF MANUAL_PWR_ON=MANUAL_PWR_ON PWR_OFF=PWR_OFF6 PWR_ON=PWR_ON6 SILICON_SN=SILICON_SN ~CARD_PRESENT=~CARD_PRESENT6 ~CS_SLOT=~CS_SLOT6
Backplane Slot7: designators C2=C2G C21=C21G C?=C?G#1 C?=C?G#2 D6=D6G J1=J1G K1=K1G P?=P?G Q1=Q1G Q2=Q2G Q?=Q?G R4=R4G R18=R18G S?=S?G TP10=TP10G TP11=TP11G U4=U4G U?=U?G#2 U?=U?G#1 U?=U?G#3; ports GPS_DATA=GPS_DATA I2C_SCL=I2C_SCL I2C_SDA=I2C_SDA IMON_SLOT=IMON_SLOT7 MANUAL_PWR_OFF=MANUAL_PWR_OFF MANUAL_PWR_ON=MANUAL_PWR_ON PWR_OFF=PWR_OFF7 PWR_ON=PWR_ON7 SILICON_SN=SILICON_SN ~CARD_PRESENT=~CARD_PRESENT7 ~CS_SLOT=~CS_SLOT7
Backplane Slot8: designators C2=C2H C21=C21H C?=C?H#1 C?=C?H#2 D6=D6H J1=J1H K1=K1H P?=P?H Q1=Q1H Q2=Q2H Q?=Q?H R4=R4H R18=R18H S?=S?H TP10=TP10H TP11=TP11H U4=U4H U?=U?H#2 U?=U?H#1 U?=U?H#3; ports GPS_DATA=GPS_DATA I2C_SCL=I2C_SCL I2C_SDA=I2C_SDA IMON_SLOT=IMON_SLOT8 MANUAL_PWR_OFF=MANUAL_PWR_OFF MANUAL_PWR_ON=MANUAL_PWR_ON PWR_OFF=PWR_OFF8 PWR_ON=PWR_ON8 SILICON_SN=SILICON_SN ~CARD_PRESENT=~CARD_PRESENT8 ~CS_SLOT=~CS_SLOT8
Backplane Slot9: designators C2=C2I C21=C21I C?=C?I#1 C?=C?I#2 D6=D6I J1=J1I K1=K1I P?=P?I Q1=Q1I Q2=Q2I Q?=Q?I R4=R4I R18=R18I S?=S?I TP10=TP10I TP11=TP11I U4=U4I U?=U?I#2 U?=U?I#1 U?=U?I#3; ports GPS_DATA=GPS_DATA I2C_SCL=I2C_SCL I2C_SDA=I2C_SDA IMON_SLOT=IMON_SLOT9 MANUAL_PWR_OFF=MANUAL_PWR_OFF MANUAL_PWR_ON=MANUAL_PWR_ON PWR_OFF=PWR_OFF9 PWR_ON=PWR_ON9 SILICON_SN=SILICON_SN ~CARD_PRESENT=~CARD_PRESENT9 ~CS_SLOT=~CS_SLOT9
Backplane Slot10: designators C2=C2J C21=C21J C?=C?J#1 C?=C?J#2 D6=D6J J1=J1J K1=K1J P?=P?J Q1=Q1J Q2=Q2J Q?=Q?J R4=R4J R18=R18J S?=S?J TP10=TP10J TP11=TP11J U4=U4J U?=U?J#2 U?=U?J#1 U?=U?J#3; ports GPS_DATA=GPS_DATA I2C_SCL=I2C_SCL I2C_SDA=I2C_SDA IMON_SLOT=IMON_SLOT10 MANUAL_PWR_OFF=MANUAL_PWR_OFF MANUAL_PWR_ON=MANUAL_PWR_ON PWR_OFF=PWR_OFF10 PWR_ON=PWR_ON10 SILICON_SN=SILICON_SN ~CARD_PRESENT=~CARD_PRESENT10 ~CS_SLOT=~CS_SLOT10
Backplane Slot11: designators C2=C2K C21=C21K C?=C?K#1 C?=C?K#2 D6=D6K J1=J1K K1=K1K P?=P?K Q1=Q1K Q2=Q2K Q?=Q?K R4=R4K R18=R18K S?=S?K TP10=TP10K TP11=TP11K U4=U4K U?=U?K#2 U?=U?K#1 U?=U?K#3; ports GPS_DATA=GPS_DATA I2C_SCL=I2C_SCL I2C_SDA=I2C_SDA IMON_SLOT=IMON_SLOT11 MANUAL_PWR_OFF=MANUAL_PWR_OFF MANUAL_PWR_ON=MANUAL_PWR_ON PWR_OFF=PWR_OFF11 PWR_ON=PWR_ON11 SILICON_SN=SILICON_SN ~CARD_PRESENT=~CARD_PRESENT11 ~CS_SLOT=~CS_SLOT11
Backplane Slot12: designators C2=C2L C21=C21L C?=C?L#1 C?=C?L#2 D6=D6L J1=J1L K1=K1L P?=P?L Q1=Q1L Q2=Q2L Q?=Q?L R4=R4L R18=R18L S?=S?L TP10=TP10L TP11=TP11L U4=U4L U?=U?L#2 U?=U?L#1 U?=U?L#3; ports GPS_DATA=GPS_DATA I2C_SCL=I2C_SCL I2C_SDA=I2C_SDA IMON_SLOT=IMON_SLOT12 MANUAL_PWR_OFF=MANUAL_PWR_OFF MANUAL_PWR_ON=MANUAL_PWR_ON PWR_OFF=PWR_OFF12 PWR_ON=PWR_ON12 SILICON_SN=SILICON_SN ~CARD_PRESENT=~CARD_PRESENT12 ~CS_SLOT=~CS_SLOT12

### Notes on the sheet
- (Card Present)
- (near S?) WRITE
- (near S?) DISABLE
- (near U?#2) 64K EPROM
- (near R4) 100 mV x 100 = 10V at ADC
- 6.25 A FS Range
- (near S?) ENABLE
- (near K1) RESET REMOVES VOLTAGE FROM SLOT
- Required Ckts for each slot PCB
- I/O active when +24V to slot is OFF
- Silicon Serial Number
- fc = 15.9 Hz
- Place/Directive/Compile Mask
- (near Q1) PWR OFF
- MANUAL ON/OFF
- (near Q2) PWR ON
- SCH, BACKPLANE, 19-INCH RACK MOUNT
- 780-00029
- 2
- 3
- (in symbol FDV304P) s

### Library data of the parts
C2 = Cap SMD: Capacitor; LCO p/n: 120-00002
C21 = Cap: as C1 on sheet 780-00029,rev3,Pg3,Backplane, Instrument Crate; Value: 1u; COST: 0.088
C?#1 C?#2 = Cap SMD: Capacitor; Manufacturer: AVX; Manuf p/n: 08055C104KAT2A; Vendor: DigiKey; Vendor p/n: 478-1395-1-ND; Vendor Mult.: 10; Arena Prefix: 120; LCO P/N: 120-00002; COST: 0.088; Arena Type: Capacitor
D6 = DIODE, PAIR, COM CATHODE: LCO p/n: 150-00095; Vendor: Digi-Key; Vendor p/n: 568-1623-1-ND
J1 = PESC-02-12-02-01-S-VT-LC: SAMTEC, SIGNAL(12)+PWR(4), VERT; LCO p/n: 125-00088; Manufacturer: Samtec; Manuf p/n: PESC-02-12-02-01-S-VT-LC; VALUE: PESC-02-12-02-01-S-VT-LC; Vendor: Samtec; Vendor p/n: PESC-02-12-02-01-S-VT-LC
K1 = Relay SPDT, 16A: Tyco/Schrack RT314F24, Dual Latching; Vendor: DigiKey; Vendor Mult.: 1; Vendor p/n: PB1086-ND; LCO p/n: 183-00001; COST: 3.79; Manufacturer: Tyco/Schrack; Manuf p/n: RT314F24
P? = PETC-02-12-02--01-S-RA-SD: SAMTEC, SIGNAL(12)+PWR(4); Vendor Mult.: 1; Manufacturer: SAMTEC; Manuf p/n: PETC-02-12-02--01-S-RA-SD; Vendor: SAMTEC; Vendor p/n: PETC-02-12-02--01-S-RA-SD
Q1 Q2 = MOSFET-N: N-Channel MOSFET; pin to pad: 1>3 2>1 3>2; Manufacturer: ZETEX; Manuf p/n: ZXMN3B01FTA; Value: ZXMN3B01; Vendor: DIGIKEY; Vendor Mult.: 1; Vendor p/n: ZXMN3B01FCT-ND; LCO p/n: 195-00002; COST: 0.69
Q? = FDV304P: P-MOSFET LOGIC LEVEL; Manufacturer: Fairchild; Vendor: DigiKey; Vendor p/n: FDV304PCT-ND; Vendor Mult.: 1; Arena Prefix: 195; Arena Type: Transistor; LCO P/N: 195-00004; COST: 0.46; Manuf p/n: FDV304P; Value: FDV304P
R4 = Res SMD: Resistor 0805; Manufacturer: Panasonic; Manuf p/n: ERJ-M1WSJ16MU; Vendor: DIGIKEY; Vendor p/n: P16TCT-ND; Vendor Mult.: 1; LCO p/n: 181-R0160; COST: 1.07
R18 = Res SMD: as R2 on sheet 780-00029,rev3,Pg3,Backplane, Instrument Crate; COST: 0.09
S? = SW_SPDT_DOUG: Manufacturer: Copal Electronics; Manuf p/n: CAS-120TA; Vendor: DIGIKEY; Vendor Mult.: 1; Vendor p/n: CAS120JTR-ND; LCO p/n: 185-00010; COST: 1.27; Value: SW_SPDT
TP10 TP11 = Test point: Manufacturer: Keystone; Manuf p/n: 1249; Vendor: Bisco Ind.; LCO p/n: 125-00013; Vendor p/n: 1249; COST: 0.18; VALUE: Test point
U4 = INA195: Current Shunt Monitor; Manufacturer: TI; Manuf p/n: INA195AIDBVR; LCO p/n: 150-00100; Vendor: Digi-Key; Vendor Mult.: 1; Vendor p/n: 296-26067-1-ND; COST: 2.80
U?#1 = SN74CBT3306PWLE: Dual FET Bus Switch; Manufacturer: TI; Manuf p/n: SN74CB3Q3306APWR; LCO p/n: 150-00083; Vendor: Digi-Key; Vendor Mult.: 1; Vendor p/n: 296-15102-1-ND; COST: 0.95
U?#2 = M24C32RMN1: 32 Kbit Serial I²C Bus EEPROM; LCO p/n: 150-00076
U?#3 = DS2411: Silicon Serial Number; Manufacturer: MAXIM; Manuf p/n: DS2411R+T&R; Vendor: DIGIKEY; Vendor p/n: DS2411R+CT-ND; Vendor Mult.: 1; LCO p/n: 150-00031; COST: 1.25; VALUE: DS2411

## Nets that join several sheets
+3.3V: 780-00029,rev3,Pg3,Backplane, Instrument Crate (9 pins), Backplane Slot1 (J1A.11), Backplane Slot2 (J1B.11), Backplane Slot3 (J1C.11), Backplane Slot4 (J1D.11), Backplane Slot5 (J1E.11), Backplane Slot6 (J1F.11), Backplane Slot7 (J1G.11), Backplane Slot8 (J1H.11), Backplane Slot9 (J1I.11), Backplane Slot10 (J1J.11), Backplane Slot11 (J1K.11), Backplane Slot12 (J1L.11)
+12V: 780-00029,rev3,Pg3,Backplane, Instrument Crate (5 pins), Backplane Slot1 (C2A.2 U4A.5), Backplane Slot2 (C2B.2 U4B.5), Backplane Slot3 (C2C.2 U4C.5), Backplane Slot4 (C2D.2 U4D.5), Backplane Slot5 (C2E.2 U4E.5), Backplane Slot6 (C2F.2 U4F.5), Backplane Slot7 (C2G.2 U4G.5), Backplane Slot8 (C2H.2 U4H.5), Backplane Slot9 (C2I.2 U4I.5), Backplane Slot10 (C2J.2 U4J.5), Backplane Slot11 (C2K.2 U4K.5), Backplane Slot12 (C2L.2 U4L.5)
+24V: 780-00029,rev3,Pg3,Backplane, Instrument Crate (5 pins), Backplane Slot1 (D6A.3 K1A.3 R4A.1 U4A.3), Backplane Slot2 (D6B.3 K1B.3 R4B.1 U4B.3), Backplane Slot3 (D6C.3 K1C.3 R4C.1 U4C.3), Backplane Slot4 (D6D.3 K1D.3 R4D.1 U4D.3), Backplane Slot5 (D6E.3 K1E.3 R4E.1 U4E.3), Backplane Slot6 (D6F.3 K1F.3 R4F.1 U4F.3), Backplane Slot7 (D6G.3 K1G.3 R4G.1 U4G.3), Backplane Slot8 (D6H.3 K1H.3 R4H.1 U4H.3), Backplane Slot9 (D6I.3 K1I.3 R4I.1 U4I.3), Backplane Slot10 (D6J.3 K1J.3 R4J.1 U4J.3), Backplane Slot11 (D6K.3 K1K.3 R4K.1 U4K.3), Backplane Slot12 (D6L.3 K1L.3 R4L.1 U4L.3)
GND: 780-00029,rev3,Pg3,Backplane, Instrument Crate (62 pins), Backplane Slot1 (6 pins), Backplane Slot2 (6 pins), Backplane Slot3 (6 pins), Backplane Slot4 (6 pins), Backplane Slot5 (6 pins), Backplane Slot6 (6 pins), Backplane Slot7 (6 pins), Backplane Slot8 (6 pins), Backplane Slot9 (6 pins), Backplane Slot10 (6 pins), Backplane Slot11 (6 pins), Backplane Slot12 (6 pins)
RTN: Backplane Slot1 (J1A.15 J1A.16), Backplane Slot2 (J1B.15 J1B.16), Backplane Slot3 (J1C.15 J1C.16), Backplane Slot4 (J1D.15 J1D.16), Backplane Slot5 (J1E.15 J1E.16), Backplane Slot6 (J1F.15 J1F.16), Backplane Slot7 (J1G.15 J1G.16), Backplane Slot8 (J1H.15 J1H.16), Backplane Slot9 (J1I.15 J1I.16), Backplane Slot10 (J1J.15 J1J.16), Backplane Slot11 (J1K.15 J1K.16), Backplane Slot12 (J1L.15 J1L.16)
GPS_DATA: 780-00029,rev3,Pg3,Backplane, Instrument Crate (P3.1), Backplane Slot1 (J1A.1), Backplane Slot2 (J1B.1), Backplane Slot3 (J1C.1), Backplane Slot4 (J1D.1), Backplane Slot5 (J1E.1), Backplane Slot6 (J1F.1), Backplane Slot7 (J1G.1), Backplane Slot8 (J1H.1), Backplane Slot9 (J1I.1), Backplane Slot10 (J1J.1), Backplane Slot11 (J1K.1), Backplane Slot12 (J1L.1)
I2C_SCL: 780-00029,rev3,Pg3,Backplane, Instrument Crate (D5.4 TP13.1 U5.A111), Backplane Slot1 (J1A.3 J1A.5), Backplane Slot2 (J1B.3 J1B.5), Backplane Slot3 (J1C.3 J1C.5), Backplane Slot4 (J1D.3 J1D.5), Backplane Slot5 (J1E.3 J1E.5), Backplane Slot6 (J1F.3 J1F.5), Backplane Slot7 (J1G.3 J1G.5), Backplane Slot8 (J1H.3 J1H.5), Backplane Slot9 (J1I.3 J1I.5), Backplane Slot10 (J1J.3 J1J.5), Backplane Slot11 (J1K.3 J1K.5), Backplane Slot12 (J1L.3 J1L.5)
I2C_SDA: 780-00029,rev3,Pg3,Backplane, Instrument Crate (D5.3 TP12.1 U5.A109), Backplane Slot1 (J1A.2), Backplane Slot2 (J1B.2), Backplane Slot3 (J1C.2), Backplane Slot4 (J1D.2), Backplane Slot5 (J1E.2), Backplane Slot6 (J1F.2), Backplane Slot7 (J1G.2), Backplane Slot8 (J1H.2), Backplane Slot9 (J1I.2), Backplane Slot10 (J1J.2), Backplane Slot11 (J1K.2), Backplane Slot12 (J1L.2)
IMON_SLOT1: 780-00029,rev3,Pg3,Backplane, Instrument Crate (U5.A21), Backplane Slot1 (C21A.1 R18A.1 TP11A.1)
IMON_SLOT2: 780-00029,rev3,Pg3,Backplane, Instrument Crate (U5.A19), Backplane Slot2 (C21B.1 R18B.1 TP11B.1)
IMON_SLOT3: 780-00029,rev3,Pg3,Backplane, Instrument Crate (U5.A17), Backplane Slot3 (C21C.1 R18C.1 TP11C.1)
IMON_SLOT4: 780-00029,rev3,Pg3,Backplane, Instrument Crate (U5.A15), Backplane Slot4 (C21D.1 R18D.1 TP11D.1)
IMON_SLOT5: 780-00029,rev3,Pg3,Backplane, Instrument Crate (U5.A13), Backplane Slot5 (C21E.1 R18E.1 TP11E.1)
IMON_SLOT6: 780-00029,rev3,Pg3,Backplane, Instrument Crate (U5.A11), Backplane Slot6 (C21F.1 R18F.1 TP11F.1)
IMON_SLOT7: 780-00029,rev3,Pg3,Backplane, Instrument Crate (U5.A9), Backplane Slot7 (C21G.1 R18G.1 TP11G.1)
IMON_SLOT8: 780-00029,rev3,Pg3,Backplane, Instrument Crate (U5.A7), Backplane Slot8 (C21H.1 R18H.1 TP11H.1)
IMON_SLOT9: 780-00029,rev3,Pg3,Backplane, Instrument Crate (U5.A29), Backplane Slot9 (C21I.1 R18I.1 TP11I.1)
IMON_SLOT10: 780-00029,rev3,Pg3,Backplane, Instrument Crate (U5.A27), Backplane Slot10 (C21J.1 R18J.1 TP11J.1)
IMON_SLOT11: 780-00029,rev3,Pg3,Backplane, Instrument Crate (U5.A25), Backplane Slot11 (C21K.1 R18K.1 TP11K.1)
IMON_SLOT12: 780-00029,rev3,Pg3,Backplane, Instrument Crate (U5.A23), Backplane Slot12 (C21L.1 R18L.1 TP11L.1)
MANUAL_PWR_OFF: 780-00029,rev3,Pg3,Backplane, Instrument Crate (U1.3), Backplane Slot1 (Q1A.2), Backplane Slot2 (Q1B.2), Backplane Slot3 (Q1C.2), Backplane Slot4 (Q1D.2), Backplane Slot5 (Q1E.2), Backplane Slot6 (Q1F.2), Backplane Slot7 (Q1G.2), Backplane Slot8 (Q1H.2), Backplane Slot9 (Q1I.2), Backplane Slot10 (Q1J.2), Backplane Slot11 (Q1K.2), Backplane Slot12 (Q1L.2)
MANUAL_PWR_ON: 780-00029,rev3,Pg3,Backplane, Instrument Crate (R3.2 S2.2), Backplane Slot1 (Q2A.2), Backplane Slot2 (Q2B.2), Backplane Slot3 (Q2C.2), Backplane Slot4 (Q2D.2), Backplane Slot5 (Q2E.2), Backplane Slot6 (Q2F.2), Backplane Slot7 (Q2G.2), Backplane Slot8 (Q2H.2), Backplane Slot9 (Q2I.2), Backplane Slot10 (Q2J.2), Backplane Slot11 (Q2K.2), Backplane Slot12 (Q2L.2)
PWR_OFF1: 780-00029,rev3,Pg3,Backplane, Instrument Crate (U5.B42), Backplane Slot1 (D6A.2 K1A.1 Q1A.1)
PWR_OFF2: 780-00029,rev3,Pg3,Backplane, Instrument Crate (U5.B46), Backplane Slot2 (D6B.2 K1B.1 Q1B.1)
PWR_OFF3: 780-00029,rev3,Pg3,Backplane, Instrument Crate (U5.B50), Backplane Slot3 (D6C.2 K1C.1 Q1C.1)
PWR_OFF4: 780-00029,rev3,Pg3,Backplane, Instrument Crate (U5.B54), Backplane Slot4 (D6D.2 K1D.1 Q1D.1)
PWR_OFF5: 780-00029,rev3,Pg3,Backplane, Instrument Crate (U5.B58), Backplane Slot5 (D6E.2 K1E.1 Q1E.1)
PWR_OFF6: 780-00029,rev3,Pg3,Backplane, Instrument Crate (U5.B62), Backplane Slot6 (D6F.2 K1F.1 Q1F.1)
PWR_OFF7: 780-00029,rev3,Pg3,Backplane, Instrument Crate (U5.B66), Backplane Slot7 (D6G.2 K1G.1 Q1G.1)
PWR_OFF8: 780-00029,rev3,Pg3,Backplane, Instrument Crate (U5.B70), Backplane Slot8 (D6H.2 K1H.1 Q1H.1)
PWR_OFF9: 780-00029,rev3,Pg3,Backplane, Instrument Crate (U5.B74), Backplane Slot9 (D6I.2 K1I.1 Q1I.1)
PWR_OFF10: 780-00029,rev3,Pg3,Backplane, Instrument Crate (U5.B78), Backplane Slot10 (D6J.2 K1J.1 Q1J.1)
PWR_OFF11: 780-00029,rev3,Pg3,Backplane, Instrument Crate (U5.B82), Backplane Slot11 (D6K.2 K1K.1 Q1K.1)
PWR_OFF12: 780-00029,rev3,Pg3,Backplane, Instrument Crate (U5.B86), Backplane Slot12 (D6L.2 K1L.1 Q1L.1)
PWR_ON1: 780-00029,rev3,Pg3,Backplane, Instrument Crate (U5.B47), Backplane Slot1 (D6A.1 K1A.2 Q2A.1)
PWR_ON2: 780-00029,rev3,Pg3,Backplane, Instrument Crate (U5.B51), Backplane Slot2 (D6B.1 K1B.2 Q2B.1)
PWR_ON3: 780-00029,rev3,Pg3,Backplane, Instrument Crate (U5.B2), Backplane Slot3 (D6C.1 K1C.2 Q2C.1)
PWR_ON4: 780-00029,rev3,Pg3,Backplane, Instrument Crate (U5.B6), Backplane Slot4 (D6D.1 K1D.2 Q2D.1)
PWR_ON5: 780-00029,rev3,Pg3,Backplane, Instrument Crate (U5.B10), Backplane Slot5 (D6E.1 K1E.2 Q2E.1)
PWR_ON6: 780-00029,rev3,Pg3,Backplane, Instrument Crate (U5.B14), Backplane Slot6 (D6F.1 K1F.2 Q2F.1)
PWR_ON7: 780-00029,rev3,Pg3,Backplane, Instrument Crate (U5.B18), Backplane Slot7 (D6G.1 K1G.2 Q2G.1)
PWR_ON8: 780-00029,rev3,Pg3,Backplane, Instrument Crate (U5.B22), Backplane Slot8 (D6H.1 K1H.2 Q2H.1)
PWR_ON9: 780-00029,rev3,Pg3,Backplane, Instrument Crate (U5.B26), Backplane Slot9 (D6I.1 K1I.2 Q2I.1)
PWR_ON10: 780-00029,rev3,Pg3,Backplane, Instrument Crate (U5.B30), Backplane Slot10 (D6J.1 K1J.2 Q2J.1)
PWR_ON11: 780-00029,rev3,Pg3,Backplane, Instrument Crate (U5.B34), Backplane Slot11 (D6K.1 K1K.2 Q2K.1)
PWR_ON12: 780-00029,rev3,Pg3,Backplane, Instrument Crate (U5.B38), Backplane Slot12 (D6L.1 K1L.2 Q2L.1)
SILICON_SN: 780-00029,rev3,Pg3,Backplane, Instrument Crate (D5.1 R13.1 U5.A95), Backplane Slot1 (J1A.6), Backplane Slot2 (J1B.6), Backplane Slot3 (J1C.6), Backplane Slot4 (J1D.6), Backplane Slot5 (J1E.6), Backplane Slot6 (J1F.6), Backplane Slot7 (J1G.6), Backplane Slot8 (J1H.6), Backplane Slot9 (J1I.6), Backplane Slot10 (J1J.6), Backplane Slot11 (J1K.6), Backplane Slot12 (J1L.6)
~CARD_PRESENT1: 780-00029,rev3,Pg3,Backplane, Instrument Crate (RN1.7), Backplane Slot1 (J1A.10)
~CARD_PRESENT2: 780-00029,rev3,Pg3,Backplane, Instrument Crate (RN1.5), Backplane Slot2 (J1B.10)
~CARD_PRESENT3: 780-00029,rev3,Pg3,Backplane, Instrument Crate (RN1.3), Backplane Slot3 (J1C.10)
~CARD_PRESENT4: 780-00029,rev3,Pg3,Backplane, Instrument Crate (RN1.1), Backplane Slot4 (J1D.10)
~CARD_PRESENT5: 780-00029,rev3,Pg3,Backplane, Instrument Crate (RN2.7), Backplane Slot5 (J1E.10)
~CARD_PRESENT6: 780-00029,rev3,Pg3,Backplane, Instrument Crate (RN2.5), Backplane Slot6 (J1F.10)
~CARD_PRESENT7: 780-00029,rev3,Pg3,Backplane, Instrument Crate (RN2.3), Backplane Slot7 (J1G.10)
~CARD_PRESENT8: 780-00029,rev3,Pg3,Backplane, Instrument Crate (RN2.1), Backplane Slot8 (J1H.10)
~CARD_PRESENT9: 780-00029,rev3,Pg3,Backplane, Instrument Crate (RN3.7), Backplane Slot9 (J1I.10)
~CARD_PRESENT10: 780-00029,rev3,Pg3,Backplane, Instrument Crate (RN3.5), Backplane Slot10 (J1J.10)
~CARD_PRESENT11: 780-00029,rev3,Pg3,Backplane, Instrument Crate (RN3.3), Backplane Slot11 (J1K.10)
~CARD_PRESENT12: 780-00029,rev3,Pg3,Backplane, Instrument Crate (RN3.1), Backplane Slot12 (J1L.10)
~CS_SLOT1: 780-00029,rev3,Pg3,Backplane, Instrument Crate (D2.1 U5.A71), Backplane Slot1 (J1A.4 J1A.9)
~CS_SLOT2: 780-00029,rev3,Pg3,Backplane, Instrument Crate (D2.3 U5.A73), Backplane Slot2 (J1B.4 J1B.9)
~CS_SLOT3: 780-00029,rev3,Pg3,Backplane, Instrument Crate (D2.5 U5.A75), Backplane Slot3 (J1C.4 J1C.9)
~CS_SLOT4: 780-00029,rev3,Pg3,Backplane, Instrument Crate (D2.4 U5.A77), Backplane Slot4 (J1D.4 J1D.9)
~CS_SLOT5: 780-00029,rev3,Pg3,Backplane, Instrument Crate (D4.1 U5.A79), Backplane Slot5 (J1E.4 J1E.9)
~CS_SLOT6: 780-00029,rev3,Pg3,Backplane, Instrument Crate (D4.3 U5.A81), Backplane Slot6 (J1F.4 J1F.9)
~CS_SLOT7: 780-00029,rev3,Pg3,Backplane, Instrument Crate (D4.5 U5.A83), Backplane Slot7 (J1G.4 J1G.9)
~CS_SLOT8: 780-00029,rev3,Pg3,Backplane, Instrument Crate (D4.4 U5.A85), Backplane Slot8 (J1H.4 J1H.9)
~CS_SLOT9: 780-00029,rev3,Pg3,Backplane, Instrument Crate (D3.1 U5.A87), Backplane Slot9 (J1I.4 J1I.9)
~CS_SLOT10: 780-00029,rev3,Pg3,Backplane, Instrument Crate (D3.3 U5.A89), Backplane Slot10 (J1J.4 J1J.9)
~CS_SLOT11: 780-00029,rev3,Pg3,Backplane, Instrument Crate (D3.5 U5.A91), Backplane Slot11 (J1K.4 J1K.9)
~CS_SLOT12: 780-00029,rev3,Pg3,Backplane, Instrument Crate (D3.4 U5.A93), Backplane Slot12 (J1L.4 J1L.9)